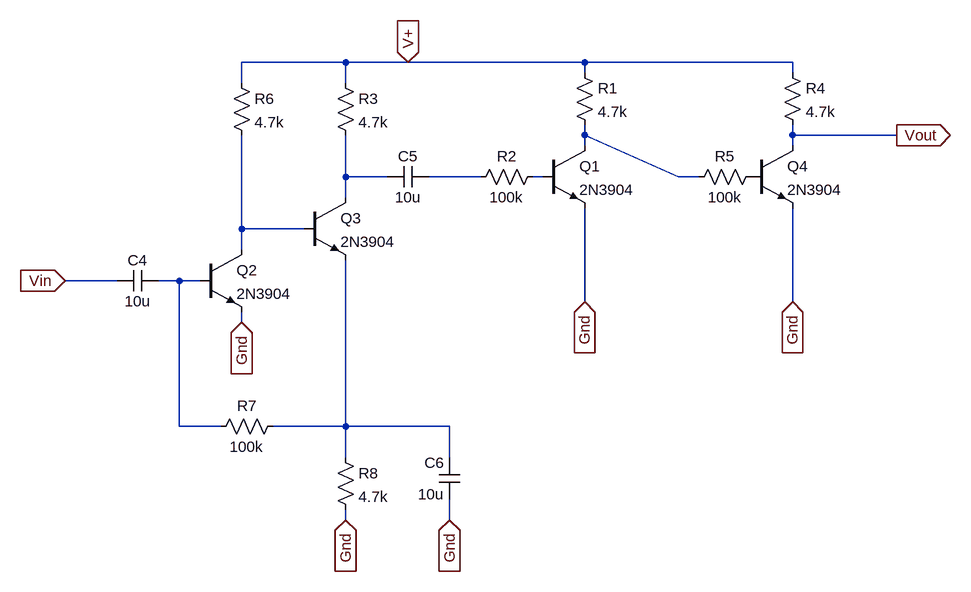
[diagram p0: schematic voltage-amplifier.asc]
voltage-amplifier.asc, the LTspice schematic file:
Version 4
SHEET 1 10304 2148
WIRE 1120 -176 960 -176
WIRE 1216 -176 1120 -176
WIRE 1488 -176 1216 -176
WIRE 1808 -176 1488 -176
WIRE 1488 -160 1488 -176
WIRE 1808 -160 1808 -176
WIRE 960 -144 960 -176
WIRE 1120 -144 1120 -176
WIRE 1488 -64 1488 -80
WIRE 1808 -64 1808 -80
WIRE 1968 -64 1808 -64
WIRE 1488 -48 1488 -64
WIRE 1808 -48 1808 -64
WIRE 1120 0 1120 -64
WIRE 1184 0 1120 0
WIRE 1328 0 1248 0
WIRE 1424 0 1408 0
WIRE 1632 0 1488 -64
WIRE 1664 0 1632 0
WIRE 1120 32 1120 0
WIRE 960 80 960 -64
WIRE 1056 80 960 80
WIRE 960 112 960 80
WIRE 768 160 688 160
WIRE 864 160 832 160
WIRE 896 160 864 160
WIRE 1488 192 1488 48
WIRE 1808 192 1808 48
WIRE 960 224 960 208
WIRE 864 384 864 160
WIRE 928 384 864 384
WIRE 1120 384 1120 128
WIRE 1120 384 1008 384
WIRE 1280 384 1120 384
WIRE 1120 432 1120 384
WIRE 1280 432 1280 384
WIRE 1120 528 1120 512
WIRE 1280 528 1280 496
FLAG 1216 -176 V+
IOPIN 1216 -176 In
FLAG 688 160 Vin
IOPIN 688 160 In
FLAG 1968 -64 Vout
IOPIN 1968 -64 Out
FLAG 1120 528 Gnd
IOPIN 1120 528 In
FLAG 1280 528 Gnd
IOPIN 1280 528 In
FLAG 960 224 Gnd
IOPIN 960 224 In
FLAG 1488 192 Gnd
IOPIN 1488 192 In
FLAG 1808 192 Gnd
IOPIN 1808 192 In
SYMBOL npn 896 112 R0
SYMATTR InstName Q2
SYMATTR Value 2N3904
SYMBOL npn 1056 32 R0
SYMATTR InstName Q3
SYMATTR Value 2N3904
SYMBOL cap 832 144 R90
WINDOW 0 0 32 VBottom 2
WINDOW 3 32 32 VTop 2
SYMATTR InstName C4
SYMATTR Value 10u
SYMBOL cap 1248 -16 R90
WINDOW 0 0 32 VBottom 2
WINDOW 3 32 32 VTop 2
SYMATTR InstName C5
SYMATTR Value 10u
SYMBOL res 1104 -160 R0
SYMATTR InstName R3
SYMATTR Value 4.7k
SYMBOL res 944 -160 R0
SYMATTR InstName R6
SYMATTR Value 4.7k
SYMBOL res 1024 368 R90
WINDOW 0 0 56 VBottom 2
WINDOW 3 32 56 VTop 2
SYMATTR InstName R7
SYMATTR Value 100k
SYMBOL res 1104 416 R0
SYMATTR InstName R8
SYMATTR Value 4.7k
SYMBOL cap 1296 496 R180
WINDOW 0 24 56 Left 2
WINDOW 3 24 8 Left 2
SYMATTR InstName C6
SYMATTR Value 10u
SYMBOL npn 1424 -48 R0
SYMATTR InstName Q1
SYMATTR Value 2N3904
SYMBOL res 1472 -176 R0
SYMATTR InstName R1
SYMATTR Value 4.7k
SYMBOL res 1424 -16 R90
WINDOW 0 0 56 VBottom 2
WINDOW 3 32 56 VTop 2
SYMATTR InstName R2
SYMATTR Value 100k
SYMBOL npn 1744 -48 R0
SYMATTR InstName Q4
SYMATTR Value 2N3904
SYMBOL res 1792 -176 R0
SYMATTR InstName R4
SYMATTR Value 4.7k
SYMBOL res 1760 -16 R90
WINDOW 0 0 56 VBottom 2
WINDOW 3 32 56 VTop 2
SYMATTR InstName R5
SYMATTR Value 100k

The netlist it stands for:
* voltage-amplifier.asc
Q2 N005 N006 Gnd 0 2N3904
Q3 N002 N005 N007 0 2N3904
C4 N006 Vin 10u
C5 N003 N002 10u
R3 V+ N002 4.7k
R6 V+ N005 4.7k
R7 N007 N006 100k
R8 N007 Gnd 4.7k
C6 Gnd N007 10u
Q1 N001 N004 Gnd 0 2N3904
R1 V+ N001 4.7k
R2 N004 N003 100k
Q4 Vout P001 Gnd 0 2N3904
R4 V+ Vout 4.7k
R5 P001 N001 100k
.model NPN NPN
.model PNP PNP
.lib standard.bjt
.backanno
.end